# Altium schematic sheet [14]-RGMII_PHY.SchDoc: RK3399 SOM Board Design V1.0
size A3; Author: ABC; Organization: Altium Limited; Address1: L3, 12a Rodborough Rd; Address2: Frenchs Forest; Address3: NSW; Address4: Australia 2086; DocumentNumber: 16; SheetNumber: 16; SheetTotal: 21; PROJECT CODE: A_V1.0
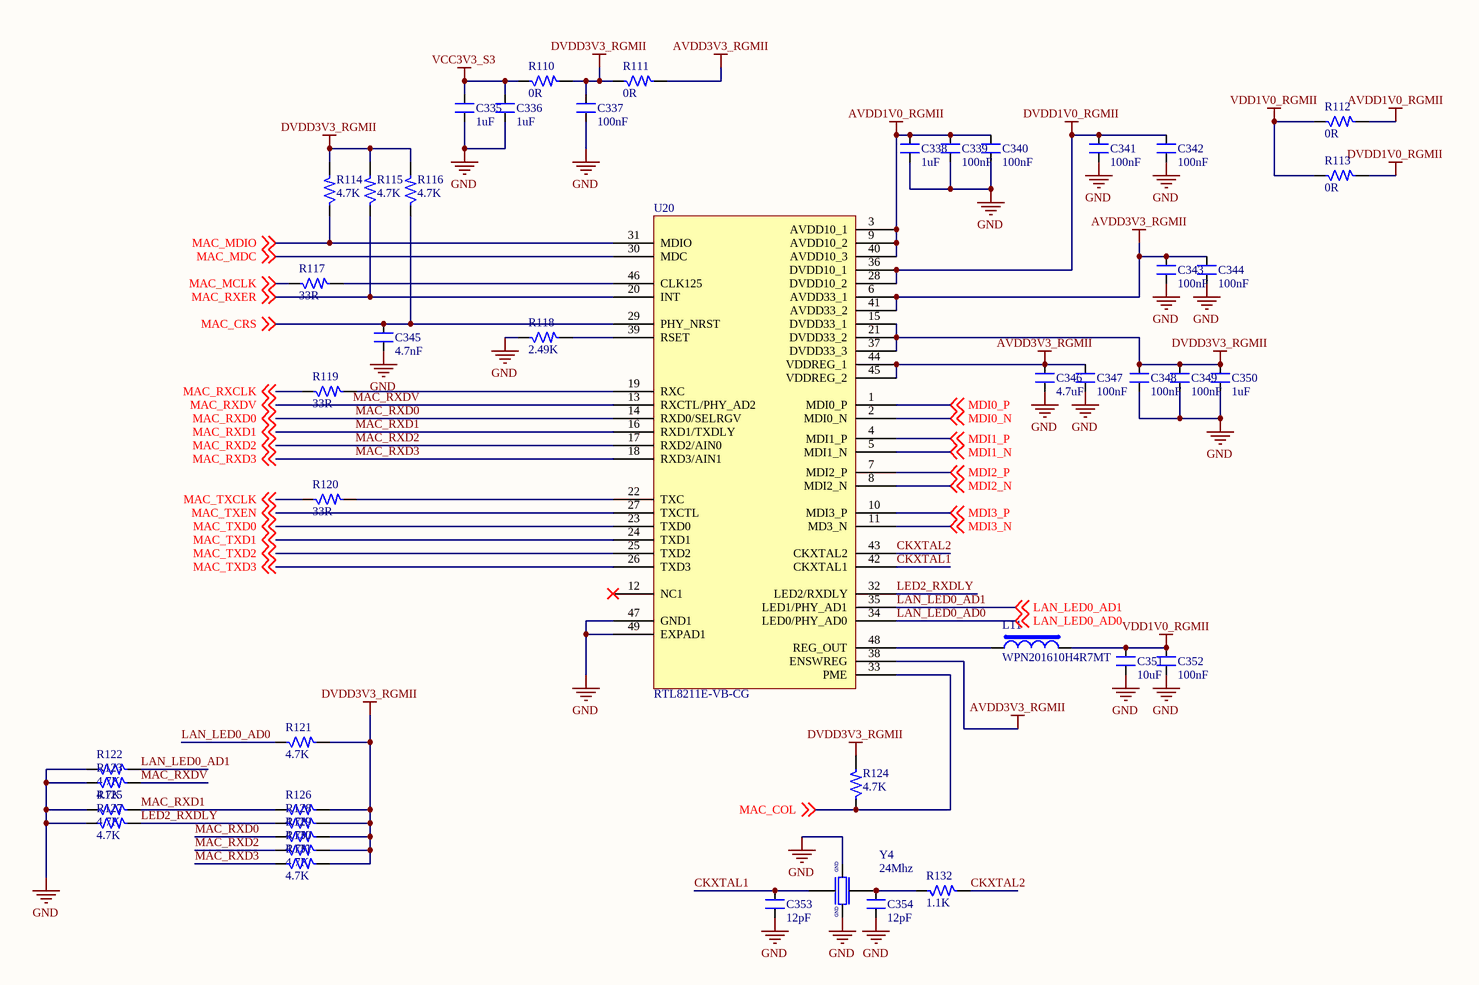
[diagram p0: [14]-RGMII_PHY.SchDoc]

## Parts
C335  1uF  [CAP_0201]
C336  1uF  [CAP_0201]
C337  100nF  [CAP_0201]
C338  1uF  [CAP_0201]
C339  100nF  [CAP_0201]
C340  100nF  [CAP_0201]
C341  100nF  [CAP_0201]
C342  100nF  [CAP_0201]
C343  100nF  [CAP_0201]
C344  100nF  [CAP_0201]
C345  4.7nF  [CAP_0201]
C346  4.7uF  [CAP_0201]
C347  100nF  [CAP_0201]
C348  100nF  [CAP_0201]
C349  100nF  [CAP_0201]
C350  1uF  [CAP_0603]
C351  10uF  [CAP_0402]
C352  100nF  [CAP_0201]
C353  12pF  [CAP_0201]
C354  12pF  [CAP_0201]
L11  WPN201610H4R7MT  [IND_62.9_110X86.6_SMD]
R110  0R  [RES_0201]
R111  0R  [RES_0201]
R112  0R  [RES_0201]
R113  0R  [RES_0201]
R114  4.7K  [RES_0201]
R115  4.7K  [RES_0201]
R116  4.7K  [RES_0201]
R117  33R  [RES_0201]
R118  2.49K  [RES_0201]
R119  33R  [RES_0201]
R120  33R  [RES_0201]
R121  4.7K  [RES_0201]
R122  4.7K  [RES_0201]
R123  4.7K  [RES_0201]
R124  4.7K  [RES_0201]
R125  4.7K  [RES_0201]
R126  4.7K  [RES_0201]
R127  4.7K  [RES_0201]
R128  4.7K  [RES_0201]
R129  4.7K  [RES_0201]
R130  4.7K  [RES_0201]
R131  4.7K  [RES_0201]
R132  1.1K  [RES_0201]
U20  RTL8211E-VB-CG  [QFN48_19.6_324X324_SMD]
Y4  24Mhz  [XTAL_ABM8AIG-24.000MHZ-12-2Z-T3]

## Nets
AVDD1V0_RGMII: C338.2 C339.2 C340.2 R112.2 U20.3(AVDD10_1) U20.9(AVDD10_2) U20.40(AVDD10_3)
AVDD3V3_RGMII: C343.2 C344.2 C346.2 C347.2 R111.2 U20.6(AVDD33_1) U20.38(ENSWREG) U20.41(AVDD33_2) U20.44(VDDREG_1) U20.45(VDDREG_2)
DVDD1V0_RGMII: C341.2 C342.2 R113.2 U20.28(DVDD10_2) U20.36(DVDD10_1)
DVDD3V3_RGMII: C337.2 C348.2 C349.2 C350.2 R110.2 R111.1 R114.2 R115.2 R116.2 R121.2 R124.2 R126.2 R128.2 R129.2 R130.2 R131.2 U20.15(DVDD33_1) U20.21(DVDD33_2) U20.37(DVDD33_3)
GND: C335.1 C336.1 C337.1 C338.1 C339.1 C340.1 C341.1 C342.1 C343.1 C344.1 C345.1 C346.1 C347.1 C348.1 C349.1 C350.1 C351.1 C352.1 C353.1 C354.1 R118.1 R122.1 R123.1 R125.1 R127.1 U20.47(GND1) U20.49(EXPAD1) Y4.2 Y4.4
VCC3V3_S3: C335.2 C336.2 R110.1
VDD1V0_RGMII: C351.2 C352.2 L11.2 R112.1 R113.1
CKXTAL1: C353.2 U20.42(CKXTAL1) Y4.1
CKXTAL2: R132.2 U20.43(CKXTAL2)
LAN_LED0_AD0: R121.1 U20.34(LED0/PHY_AD0) ; off-sheet LAN_LED0_AD0
LAN_LED0_AD1: R122.2 U20.35(LED1/PHY_AD1) ; off-sheet LAN_LED0_AD1
LED2_RXDLY: R127.2 R128.1 U20.32(LED2/RXDLY)
MAC_COL: R124.1 U20.33(PME) ; off-sheet MAC_COL
MAC_CRS: C345.2 R116.1 U20.29(PHY_NRST) ; off-sheet MAC_CRS
MAC_MCLK: R117.1 ; off-sheet MAC_MCLK
MAC_MDC: U20.30(MDC) ; off-sheet MAC_MDC
MAC_MDIO: R114.1 U20.31(MDIO) ; off-sheet MAC_MDIO
MAC_RXCLK: R119.1 ; off-sheet MAC_RXCLK
MAC_RXD0: R129.1 U20.14(RXD0/SELRGV) ; off-sheet MAC_RXD0
MAC_RXD1: R125.2 R126.1 U20.16(RXD1/TXDLY) ; off-sheet MAC_RXD1
MAC_RXD2: R130.1 U20.17(RXD2/AIN0) ; off-sheet MAC_RXD2
MAC_RXD3: R131.1 U20.18(RXD3/AIN1) ; off-sheet MAC_RXD3
MAC_RXDV: R123.2 U20.13(RXCTL/PHY_AD2) ; off-sheet MAC_RXDV
MAC_RXER: R115.1 U20.20(INT) ; off-sheet MAC_RXER
MAC_TXCLK: R120.1 ; off-sheet MAC_TXCLK
MAC_TXD0: U20.23(TXD0) ; off-sheet MAC_TXD0
MAC_TXD1: U20.24(TXD1) ; off-sheet MAC_TXD1
MAC_TXD2: U20.25(TXD2) ; off-sheet MAC_TXD2
MAC_TXD3: U20.26(TXD3) ; off-sheet MAC_TXD3
MAC_TXEN: U20.27(TXCTL) ; off-sheet MAC_TXEN
MDI0_N: U20.2(MDI0_N) ; off-sheet MDI0_N
MDI0_P: U20.1(MDI0_P) ; off-sheet MDI0_P
MDI1_N: U20.5(MDI1_N) ; off-sheet MDI1_N
MDI1_P: U20.4(MDI1_P) ; off-sheet MDI1_P
MDI2_N: U20.8(MDI2_N) ; off-sheet MDI2_N
MDI2_P: U20.7(MDI2_P) ; off-sheet MDI2_P
MDI3_N: U20.11(MD3_N) ; off-sheet MDI3_N
MDI3_P: U20.10(MDI3_P) ; off-sheet MDI3_P
NetC354_2: C354.2 R132.1 Y4.3
NetL11_1: L11.1 U20.48(REG_OUT)
NetR117_2: R117.2 U20.46(CLK125)
NetR118_2: R118.2 U20.39(RSET)
NetR119_2: R119.2 U20.19(RXC)
NetR120_2: R120.2 U20.22(TXC)

Not connected (* = marked no-connect by the designer): U20 12(NC1)*

## Notes on the sheet
- TITLE:
- DOCUMENT NAME:
- SCALE 1:1
- This document is copyright of Esteempcb and shall not be revealed, produced, copied, in whole or in part, nor
- PROJECT CODE:
- TEMPLATE:
- A3
- AUTHOR:
- Sheet
- of
- used for any purpose other than submitted.
- (in symbol XTAL_24Mhz-12pF-4-SMD) GND

## Library data of the parts
C335 C336 C338 = CAP_1uF-16V-10%-0201: 1µF ±20% 16V Ceramic Capacitor X5R 0201 (0603 Metric) /; Manufacturer: Samsung Electro-Mechanics; Manufacturer Part Number: CL03A105MO3NRNH; Case/Package: 0201; Supplier-1: Digikey
C337 C339-C344 C347-C349 C352 = CAP_100nF-25V-10%-0201: 0.1µF ±10% 25V Ceramic Capacitor X5R 0201 (0603 Metric) /; Manufacturer: TDK Corporation; Manufacturer Part Number: C0603X5R1E104K030BB; Case/Package: 0201; Supplier-1: Digikey
C345 = CAP_4.7nF-10V-10%-0201: 4700pF ±10% 10V Ceramic Capacitor X7R 0201 (0603 Metric) /; Manufacturer: AVX Corporation; Manufacturer Part Number: 0201ZC472KAT2A; Case/Package: 0201; Supplier-1: Digikey
C346 = CAP_4.7uF-6.3V-20%-0201: 4.7µF ±20% 6.3V Ceramic Capacitor X5R 0201 (0603 Metric) /; Manufacturer: Murata Electronics; Manufacturer Part Number: GRM035R60J475ME15D; Case/Package: 0201; Supplier-1: Digikey
C350 = CAP_1uF-10V-5%-0603: 1µF ±10% 10V Ceramic Capacitor X5R 0603 (1608 Metric) /; Manufacturer: Samsung Electro-Mechanics; Manufacturer Part Number: CL10A105KP8NNNC; Case/Package: 0603; Supplier-1: Digikey
C351 = CAP_10uF-10V-20%-0402: 10µF ±20% 10V Ceramic Capacitor X5R 0402 (1005 Metric) /; Manufacturer Part Number: CL05A106MP5NUNC; Manufacturer: Samsung Electro-Mechanics; Case/Package: 0402; Supplier-1: Digikey
C353 C354 = CAP_12pF-16V-10%-0201: 12pF ±10% 16V Ceramic Capacitor C0G, NP0 0201 (0603 Metric) /; Manufacturer: AVX Corporation; Manufacturer Part Number: 0201YA120KAT2A; Case/Package: 0201; Supplier-1: Digikey
L11 = IND_4.7uH-0.9A-20%-SMD: 4.7uH ±20% 900mA 425mΩ SMD,2.0x1.6x1.0mm Power Inductors RoHS /; Manufacturer: Sunlord; Manufacturer Part Number: WPN201610H4R7MT; Case/Package: SMD; Supplier-1: LCSC
R110-R113 = RES_0R-0.05W-1%-0201: 0 Ohms Jumper 0.05W, 1/20W Chip Resistor 0201 (0603 Metric) Automotive AEC-Q200 Thick Film; Manufacturer: Bourns Inc.; Manufacturer Part Number: CR0201AJ/-000GLF; Case/Package: 0201; Supplier-1: Digikey
R114-R116 R121-R131 = RES_4.7K-0.1W-1%-0201: 4.02 kOhms ±1% 0.05W, 1/20W Chip Resistor 0201 (0603 Metric) Thick Film /; Manufacturer: Yageo; Manufacturer Part Number: RC0201FR-074K02L; Case/Package: 0201; Supplier-1: Digikey
R117 R119 R120 = RES_33R-0.05W-1%-0201: 33 Ohms ±1% 0.05W, 1/20W Chip Resistor 0201 (0603 Metric) Thick Film /; Manufacturer: Yageo; Manufacturer Part Number: RC0201FR-0733RL; Case/Package: 0201; Supplier-1: Digikey
R118 = RES_2.49K-0.05W-1%-0201: 2.49 kOhms ±1% 0.05W, 1/20W Chip Resistor 0201 (0603 Metric) Automotive AEC-Q200 Thick Film /; Manufacturer: Panasonic Electronic Components; Manufacturer Part Number: ERJ-1GNF2491C; Case/Package: 0201; Supplier-1: Digikey
R132 = RES_1.1K-0.05W-1%-0201: 1.1 kOhms ±1% 0.05W, 1/20W Chip Resistor 0201 (0603 Metric) Automotive AEC-Q200 Thick Film /; Manufacturer: Panasonic Electronic Components; Manufacturer Part Number: ERJ-1GNF1101C; Case/Package: 0201; Supplier-1: Digikey
U20 = IC_RTL8211E-VB-CG: Ethernet Transceivers 10/100/1000 Base-T PHY GMII, MII, RGMII 1.43V ~ 3.63V QFN-48_6x6x04P Ethernet ICs RoHS; Manufacturer: Realtek Semicon; Manufacturer Part Number: RTL8211E-VB-CG; Case/Package: QFN-48; Supplier-1: LCSC
Y4 = XTAL_24Mhz-12pF-4-SMD: 24MHz ±20ppm Crystal 12pF 50 Ohms 4-SMD, No Lead /; Manufacturer: Abracon LLC; Manufacturer Part Number: ABM8AIG-24.000MHZ-12-2Z-T3; Case/Package: SMD; Supplier-1: Digikey